# Altium schematic sheet Inverter_540VDC_V2.SchDoc
size A0; SheetNumber: 1; SheetTotal: 1; SPICEModelCacheYQEDCYZF: <root> / <DocumentId>YQEDCYZF</DocumentId> / </root>
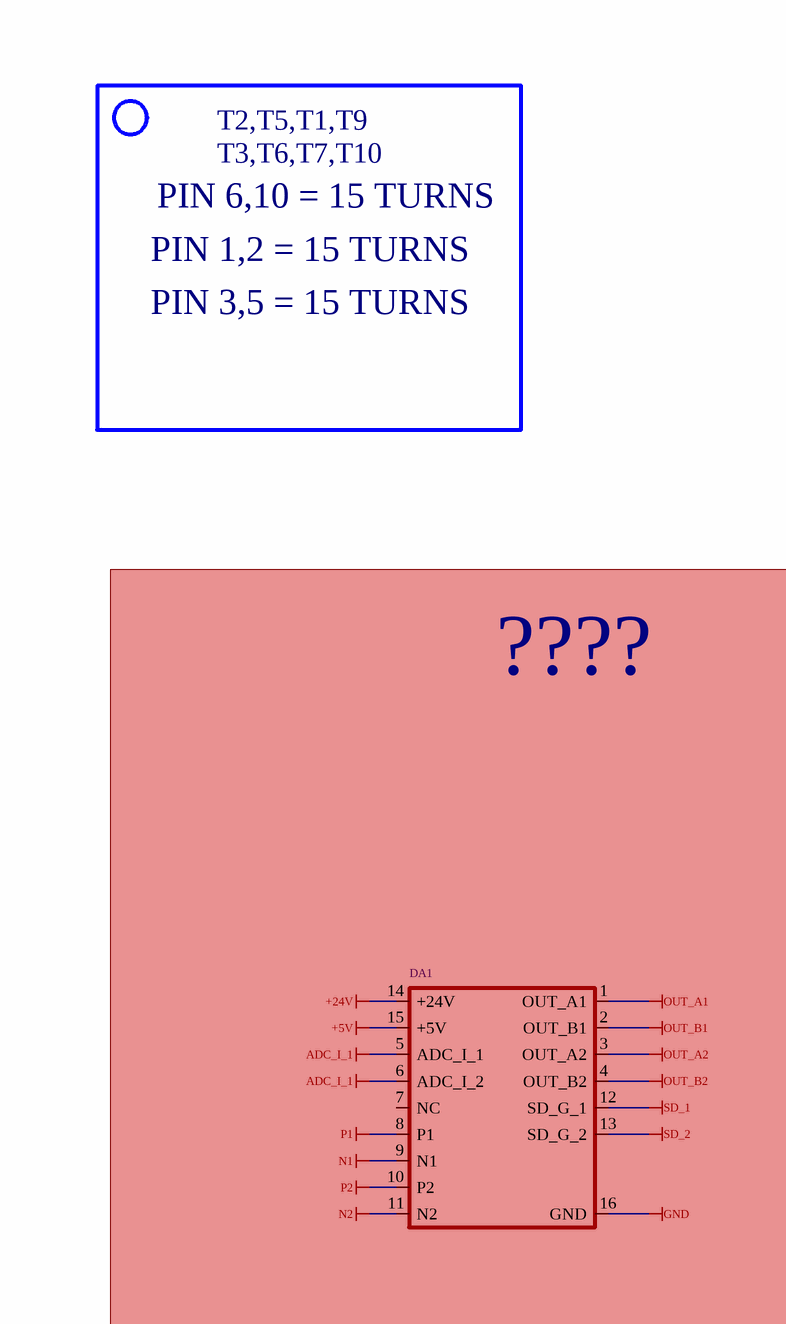
[diagram p0: Inverter_540VDC_V2.SchDoc, top left]
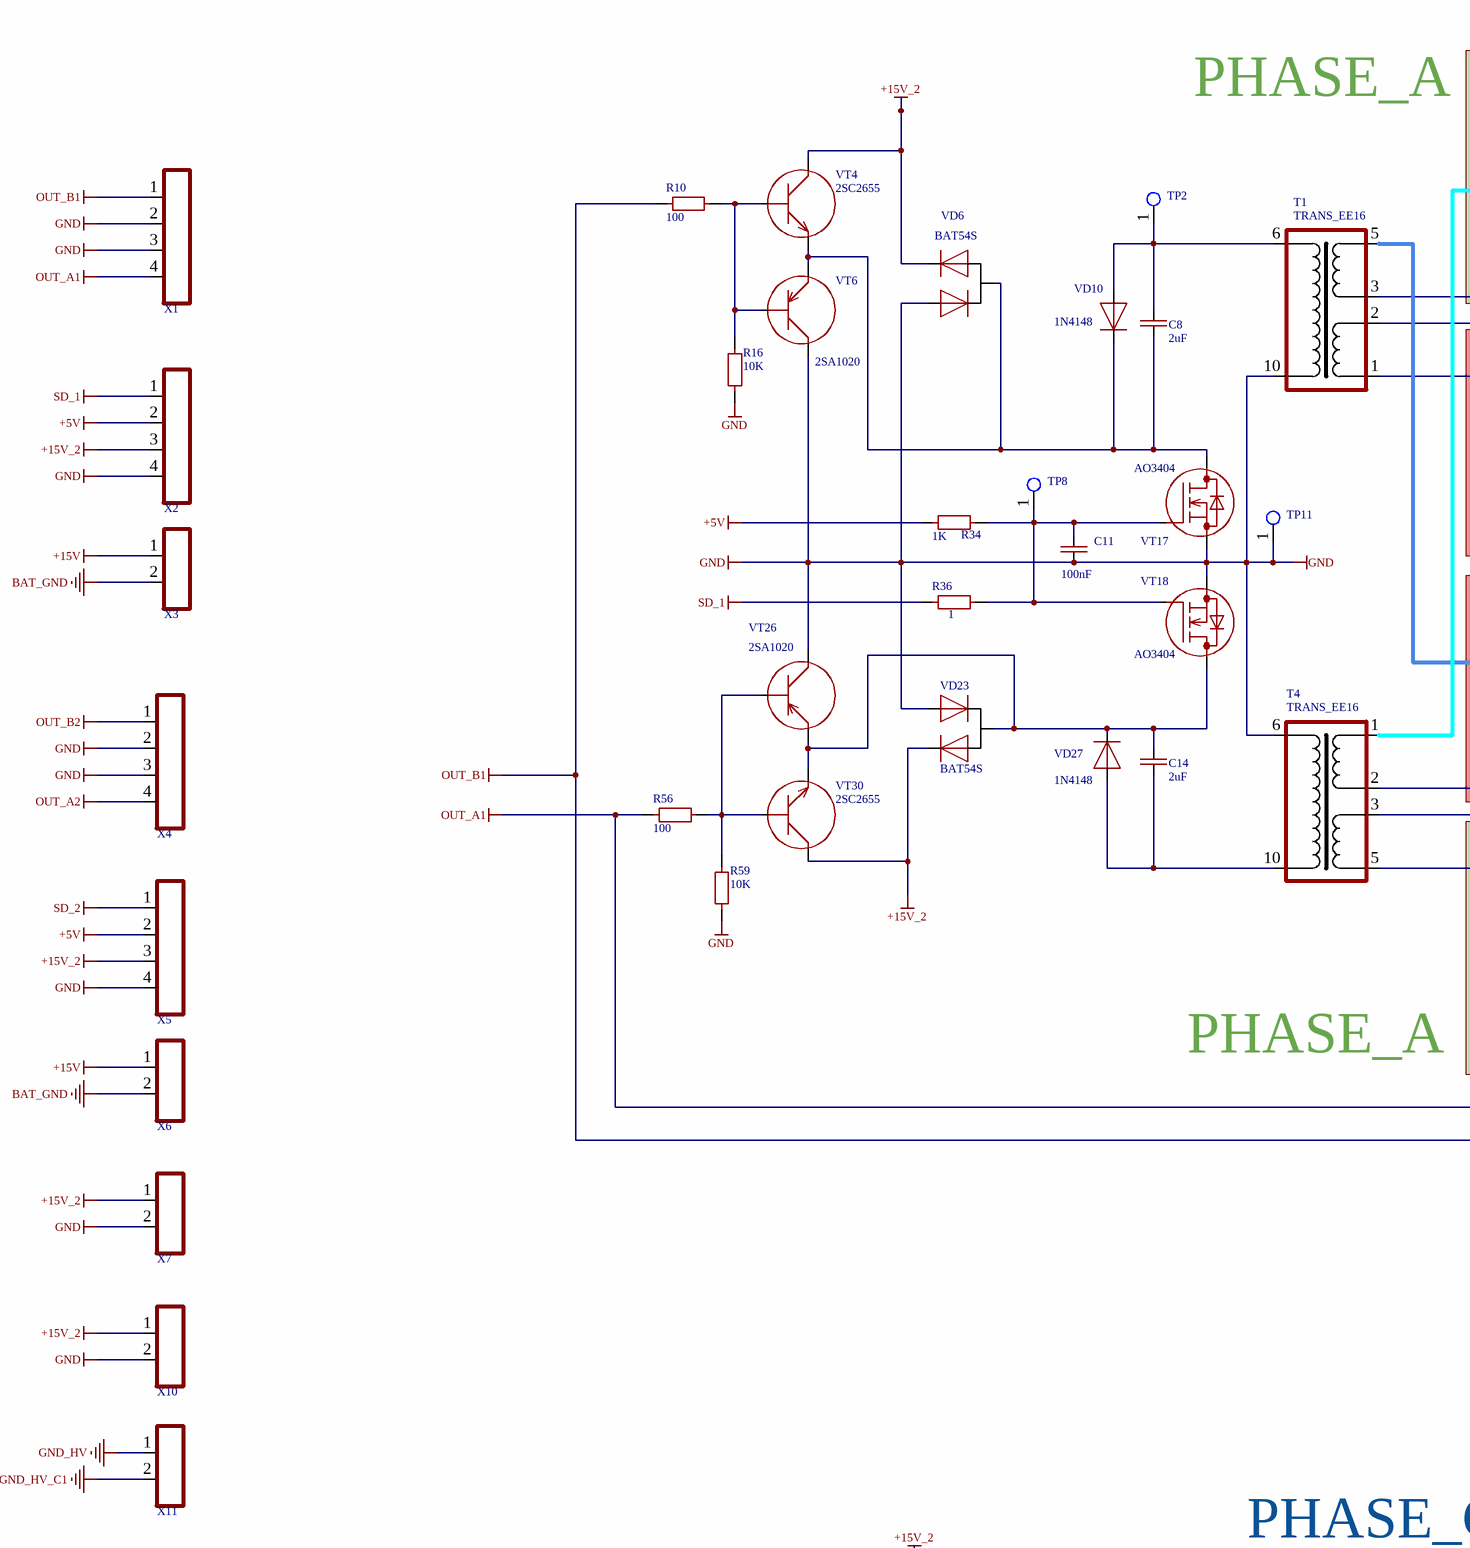
[diagram p1: Inverter_540VDC_V2.SchDoc, top middle]
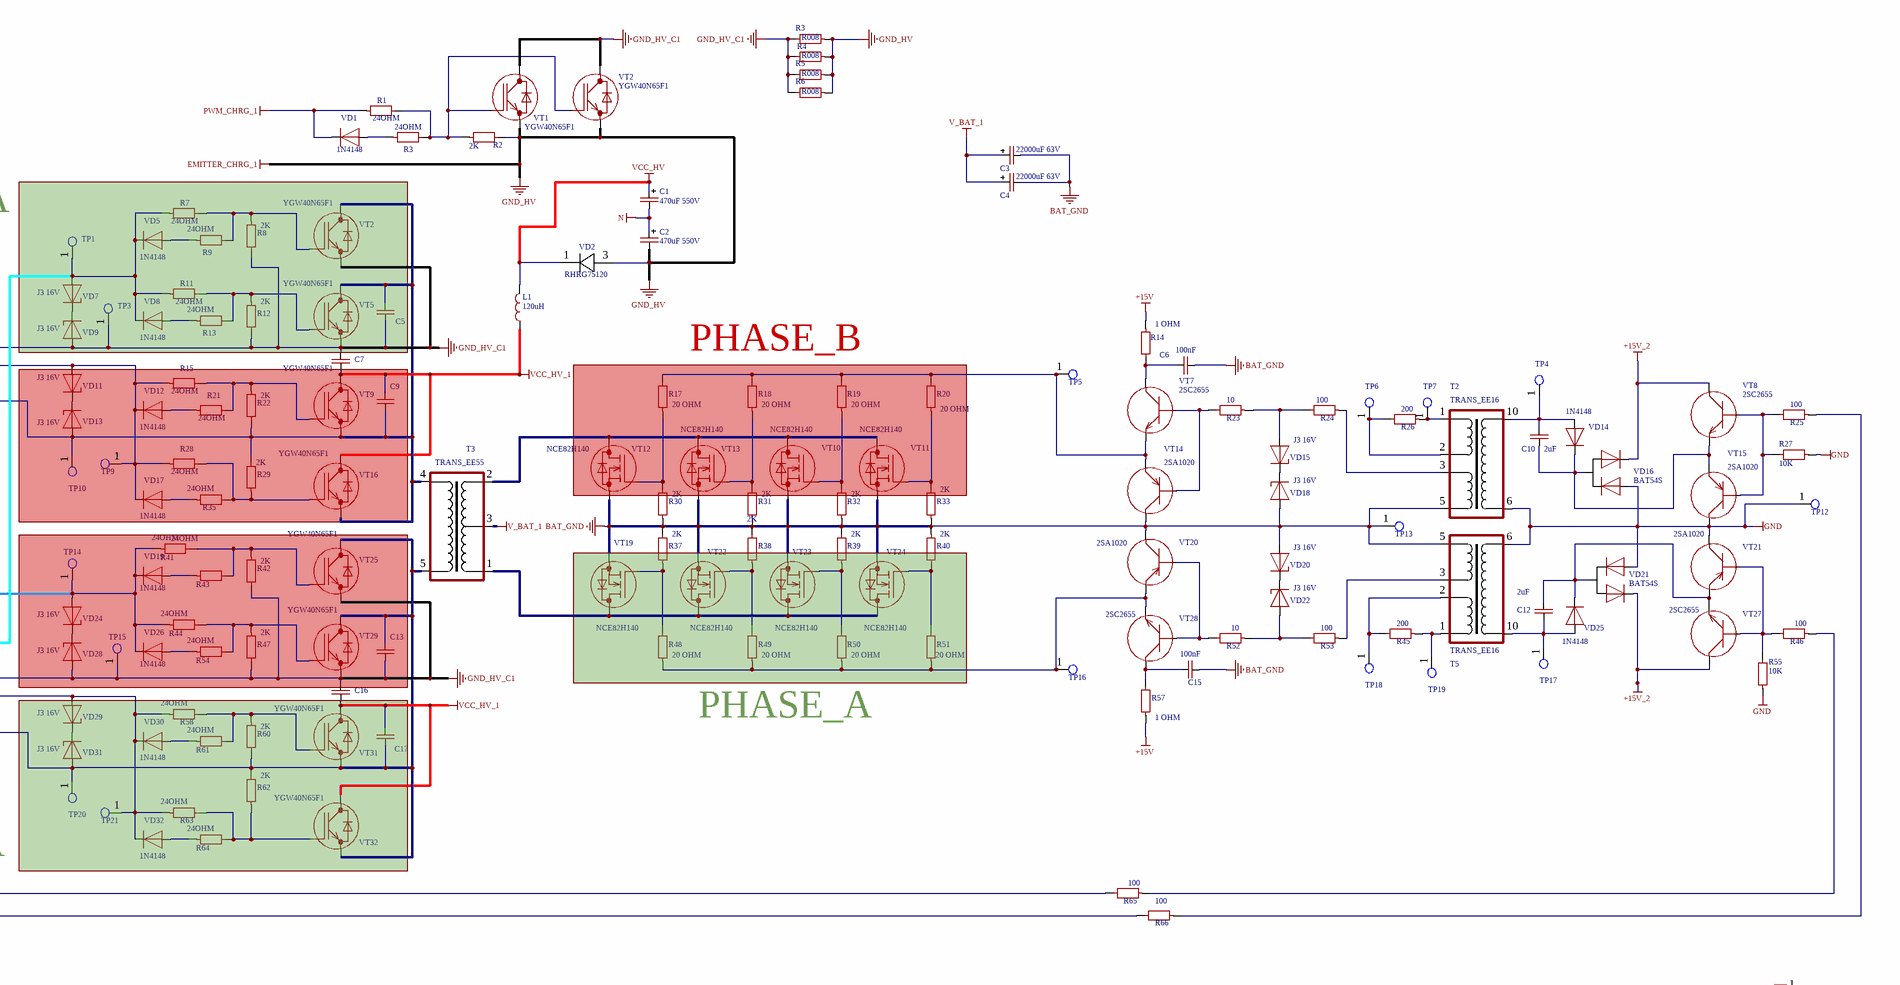
[diagram p2: Inverter_540VDC_V2.SchDoc, top right]
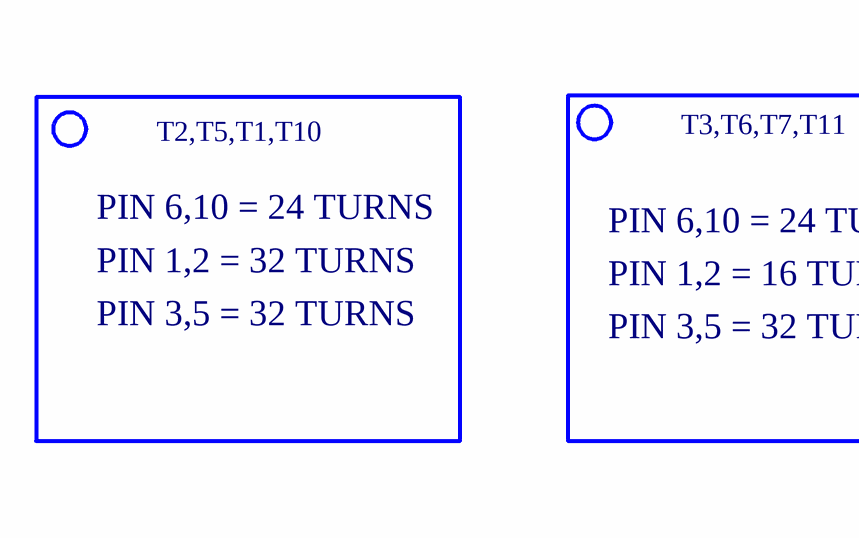
[diagram p3: Inverter_540VDC_V2.SchDoc, bottom left]
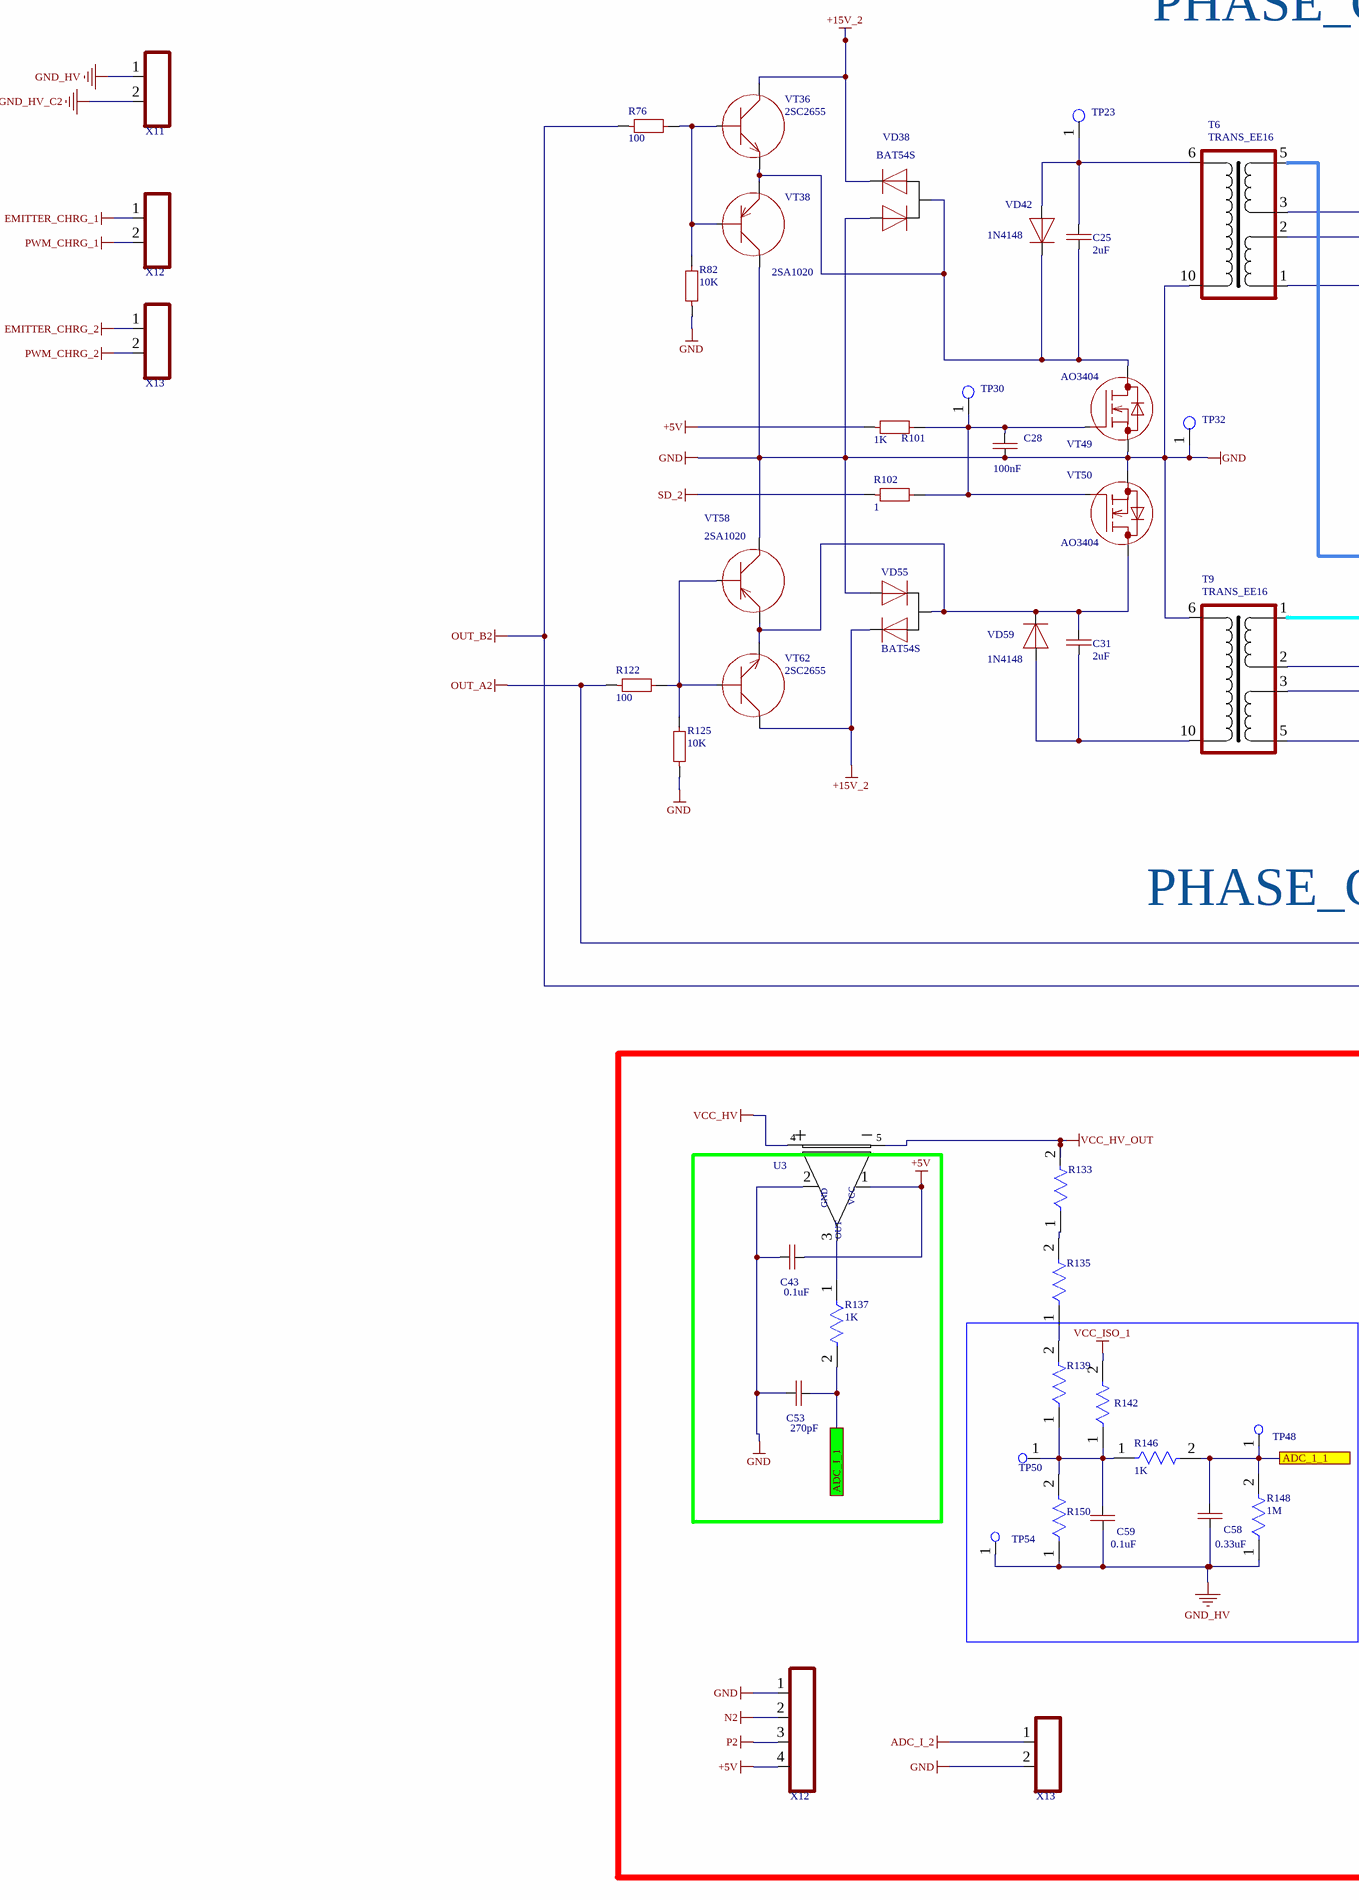
[diagram p4: Inverter_540VDC_V2.SchDoc, bottom middle]
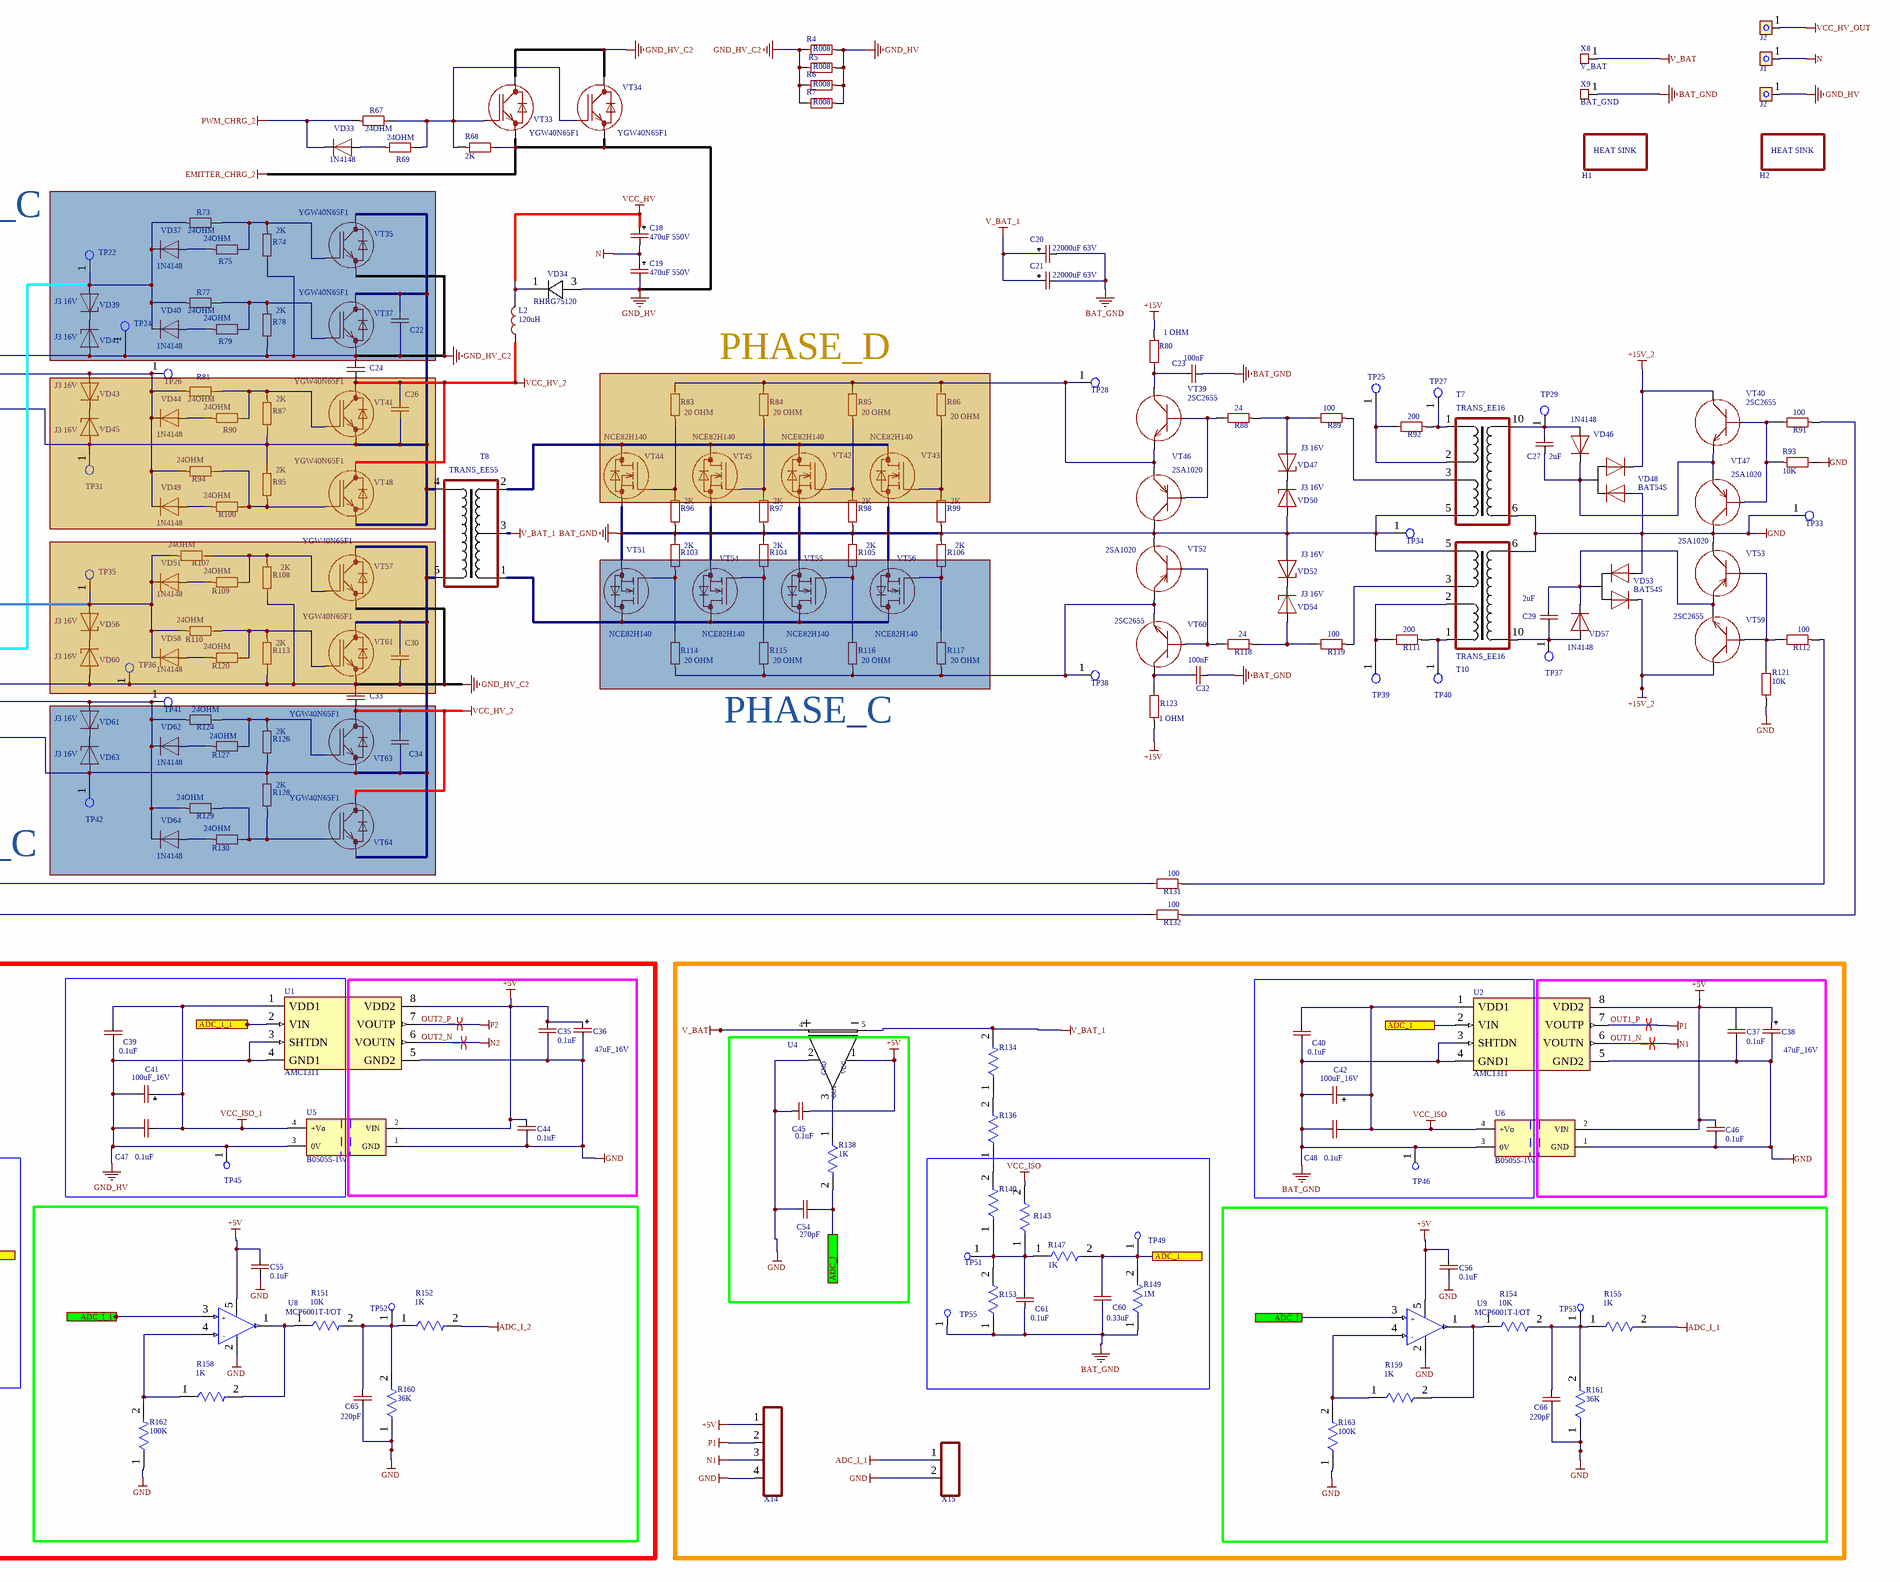
[diagram p5: Inverter_540VDC_V2.SchDoc, bottom right]

## Parts
(Parts that share a designator on the sheet are numbered #1, #2 ... from top to bottom, then left to right.)
C1  470uF 550V  [CAPPOL-65x35]
C2  470uF 550V  [CAPPOL-65x35]
C3  22000uF 63V  [CAPPOL-100x35]
C4  22000uF 63V  [CAPPOL-100x35]
C5  CAP-NON-POLAR  [CAP-FILM-22.5X26.5X10]  (value not drawn)
C6  100nF  [CAP-0805]
C7  CAP-NON-POLAR  [CAP-FILM-22.5X26.5X10]  (value not drawn)
C8  2uF  [CAP-1206]
C9  CAP-NON-POLAR  [CAP-FILM-22.5X26.5X10]  (value not drawn)
C10  2uF  [CAP-1206]
C11  100nF  [CAP-1206]
C12  2uF  [CAP-1206]
C13  CAP-NON-POLAR  [CAP-FILM-22.5X26.5X10]  (value not drawn)
C14  2uF  [CAP-1206]
C15  100nF  [CAP-0805]
C16  CAP-NON-POLAR  [CAP-FILM-22.5X26.5X10]  (value not drawn)
C17  CAP-NON-POLAR  [CAP-FILM-22.5X26.5X10]  (value not drawn)
C18  470uF 550V  [CAPPOL-65x35]
C19  470uF 550V  [CAPPOL-65x35]
C20  22000uF 63V  [CAPPOL-100x35]
C21  22000uF 63V  [CAPPOL-100x35]
C22  CAP-NON-POLAR  [CAP-FILM-22.5X26.5X10]  (value not drawn)
C23  100nF  [CAP-0805]
C24  CAP-NON-POLAR  [CAP-FILM-22.5X26.5X10]  (value not drawn)
C25  2uF  [CAP-1206]
C26  CAP-NON-POLAR  [CAP-FILM-22.5X26.5X10]  (value not drawn)
C27  2uF  [CAP-1206]
C28  100nF  [CAP-1206]
C29  2uF  [CAP-1206]
C30  CAP-NON-POLAR  [CAP-FILM-22.5X26.5X10]  (value not drawn)
C31  2uF  [CAP-1206]
C32  100nF  [CAP-0805]
C33  CAP-NON-POLAR  [CAP-FILM-22.5X26.5X10]  (value not drawn)
C34  CAP-NON-POLAR  [CAP-FILM-22.5X26.5X10]  (value not drawn)
C35  0.1uF  [CAP-0805]
C36  47uF_16V  [CAP-TAN-D]
C37  0.1uF  [CAP-0805]
C38  47uF_16V  [CAP-TAN-D]
C39  0.1uF  [CAP-0805]
C40  0.1uF  [CAP-0805]
C41  100uF_16V  [CAP-TAN-D]
C42  100uF_16V  [CAP-TAN-D]
C43  0.1uF  [CAP-0805]
C44  0.1uF  [CAP-0805]
C45  0.1uF  [CAP-0805]
C46  0.1uF  [CAP-0805]
C47  0.1uF  [CAP-0805]
C48  0.1uF  [CAP-0805]
C53  270pF  [CAP-0805]
C54  270pF  [CAP-0805]
C55  0.1uF  [CAP-0805]
C56  0.1uF  [CAP-0805]
C58  0.33uF  [CAP-0805]
C59  0.1uF  [CAP-0805]
C60  0.33uF  [CAP-0805]
C61  0.1uF  [CAP-1206]
C65  220pF  [CAP-0805]
C66  220pF  [CAP-0805]
DA1  PWM_X2_SG3525  [PWM_X2_SG3525]  (value not drawn)
H1  HEAT SINK  [HEAT SINK]  (value not drawn)
H2  HEAT SINK  [HEAT SINK]  (value not drawn)
J1  MG_136_HT  [Conn_MEIGAN_MG136HT]  (value not drawn)
J2#1  MG_136_HT  [Conn_MEIGAN_MG136HT]  (value not drawn)
J2#2  MG_136_HT  [Conn_MEIGAN_MG136HT]  (value not drawn)
L1  120uH  [DROSSEL_TOR_50X30X20]
L2  120uH  [DROSSEL_TOR_50X30X20]
R1  24OHM  [RES-0805]
R2  2K  [RES-0805]
R3#1  R008  [RES-3921]
R3#2  24OHM  [RES-0805]
R4#1  R008  [RES-3921]
R4#2  R008  [RES-3921]
R5#1  R008  [RES-3921]
R5#2  R008  [RES-3921]
R6#1  R008  [RES-3921]
R6#2  R008  [RES-3921]
R7#1  24OHM  [RES-0805]
R7#2  R008  [RES-3921]
R8  2K  [RES-0805]
R9  24OHM  [RES-0805]
R10  100  [RES-0805]
R11  24OHM  [RES-0805]
R12  2K  [RES-0805]
R13  24OHM  [RES-0805]
R14  1 OHM  [RES-2512]
R15  24OHM  [RES-0805]
R16  10K  [RES-0805]
R17  20 OHM  [RES-0805]
R18  20 OHM  [RES-0805]
R19  20 OHM  [RES-0805]
R20  20 OHM  [RES-0805]
R21  24OHM  [RES-0805]
R22  2K  [RES-0805]
R23  10  [RES-0805]
R24  100  [RES-0805]
R25  100  [RES-0805]
R26  200  [RES-2512]
R27  10K  [RES-0805]
R28  24OHM  [RES-0805]
R29  2K  [RES-0805]
R30  2K  [RES-0805]
R31  2K  [RES-0805]
R32  2K  [RES-0805]
R33  2K  [RES-0805]
R34  1K  [RES-0805]
R35  24OHM  [RES-0805]
R36  1  [RES-0805]
R37  2K  [RES-0805]
R38  2K  [RES-0805]
R39  2K  [RES-0805]
R40  2K  [RES-0805]
R41  24OHM  [RES-0805]
R42  2K  [RES-0805]
R43  24OHM  [RES-0805]
R44  24OHM  [RES-0805]
R45  200  [RES-2512]
R46  100  [RES-0805]
R47  2K  [RES-0805]
R48  20 OHM  [RES-0805]
R49  20 OHM  [RES-0805]
R50  20 OHM  [RES-0805]
R51  20 OHM  [RES-0805]
R52  10  [RES-0805]
R53  100  [RES-0805]
R54  24OHM  [RES-0805]
R55  10K  [RES-0805]
R56  100  [RES-0805]
R57  1 OHM  [RES-2512]
R58  24OHM  [RES-0805]
R59  10K  [RES-0805]
R60  2K  [RES-0805]
R61  24OHM  [RES-0805]
R62  2K  [RES-0805]
R63  24OHM  [RES-0805]
R64  24OHM  [RES-0805]
R65  100  [RES-0805]
R66  100  [RES-0805]
R67  24OHM  [RES-0805]
R68  2K  [RES-0805]
R69  24OHM  [RES-0805]
R73  24OHM  [RES-0805]
R74  2K  [RES-0805]
R75  24OHM  [RES-0805]
R76  100  [RES-0805]
R77  24OHM  [RES-0805]
R78  2K  [RES-0805]
R79  24OHM  [RES-0805]
R80  1 OHM  [RES-2512]
R81  24OHM  [RES-0805]
R82  10K  [RES-0805]
R83  20 OHM  [RES-0805]
R84  20 OHM  [RES-0805]
R85  20 OHM  [RES-0805]
R86  20 OHM  [RES-0805]
R87  2K  [RES-0805]
R88  24  [RES-0805]
R89  100  [RES-0805]
R90  24OHM  [RES-0805]
R91  100  [RES-0805]
R92  200  [RES-2512]
R93  10K  [RES-0805]
R94  24OHM  [RES-0805]
R95  2K  [RES-0805]
R96  2K  [RES-0805]
R97  2K  [RES-0805]
R98  2K  [RES-0805]
R99  2K  [RES-0805]
R100  24OHM  [RES-0805]
R101  1K  [RES-0805]
R102  1  [RES-0805]
R103  2K  [RES-0805]
R104  2K  [RES-0805]
R105  2K  [RES-0805]
R106  2K  [RES-0805]
R107  24OHM  [RES-0805]
R108  2K  [RES-0805]
R109  24OHM  [RES-0805]
R110  24OHM  [RES-0805]
R111  200  [RES-2512]
R112  100  [RES-0805]
R113  2K  [RES-0805]
R114  20 OHM  [RES-0805]
R115  20 OHM  [RES-0805]
R116  20 OHM  [RES-0805]
R117  20 OHM  [RES-0805]
R118  24  [RES-0805]
R119  100  [RES-0805]
R120  24OHM  [RES-0805]
R121  10K  [RES-0805]
R122  100  [RES-0805]
R123  1 OHM  [RES-2512]
R124  24OHM  [RES-0805]
R125  10K  [RES-0805]
R126  2K  [RES-0805]
R127  24OHM  [RES-0805]
R128  2K  [RES-0805]
R129  24OHM  [RES-0805]
R130  24OHM  [RES-0805]
R131  100  [RES-0805]
R132  100  [RES-0805]
R133  (no value)  [RES-1206]
R134  (no value)  [RES-1206]
R135  (no value)  [RES-1206]
R136  (no value)  [RES-1206]
R137  1K  [RES-0805]
R138  1K  [RES-0805]
R139  (no value)  [RES-1206]
R140  (no value)  [RES-1206]
R142  (no value)  [RES-0805]
R143  (no value)  [RES-0805]
R146  1K  [RES-0805]
R147  1K  [RES-0805]
R148  1M  [RES-0805]
R149  1M  [RES-0805]
R150  RES_1210  [RES_SMD_1210_IPC_B]  (value not drawn)
R151  10K  [RES-0805]
R152  1K  [RES-0805]
R153  RES_1210  [RES_SMD_1210_IPC_B]  (value not drawn)
R154  10K  [RES-0805]
R155  1K  [RES-0805]
R158  1K  [RES-0805]
R159  1K  [RES-0805]
R160  36K  [RES-0805]
R161  36K  [RES-0805]
R162  100K  [RES-0805]
R163  100K  [RES-0805]
T1  TRANS_EE16  [TRANS_EE16]
T2  TRANS_EE16  [TRANS_EE16]
T3  TRANS_EE55  [TRANS_EE55]
T4  TRANS_EE16  [TRANS_EE16]
T5  TRANS_EE16  [TRANS_EE16]
T6  TRANS_EE16  [TRANS_EE16]
T7  TRANS_EE16  [TRANS_EE16]
T8  TRANS_EE55  [TRANS_EE55_1]
T9  TRANS_EE16  [TRANS_EE16]
T10  TRANS_EE16  [TRANS_EE16]
TP1  Test_Point_PCB  [Test_Point]  (value not drawn)
TP2  Test_Point_PCB  [Test_Point]  (value not drawn)
TP3  Test_Point_PCB  [Test_Point]  (value not drawn)
TP4  Test_Point_PCB  [Test_Point]  (value not drawn)
TP5  Test_Point_PCB  [Test_Point]  (value not drawn)
TP6  Test_Point_PCB  [Test_Point]  (value not drawn)
TP7  Test_Point_PCB  [Test_Point]  (value not drawn)
TP8  Test_Point_PCB  [Test_Point]  (value not drawn)
TP9  Test_Point_PCB  [Test_Point]  (value not drawn)
TP10  Test_Point_PCB  [Test_Point]  (value not drawn)
TP11  Test_Point_PCB  [Test_Point]  (value not drawn)
TP12  Test_Point_PCB  [Test_Point]  (value not drawn)
TP13  Test_Point_PCB  [Test_Point]  (value not drawn)
TP14  Test_Point_PCB  [Test_Point]  (value not drawn)
TP15  Test_Point_PCB  [Test_Point]  (value not drawn)
TP16  Test_Point_PCB  [Test_Point]  (value not drawn)
TP17  Test_Point_PCB  [Test_Point]  (value not drawn)
TP18  Test_Point_PCB  [Test_Point]  (value not drawn)
TP19  Test_Point_PCB  [Test_Point]  (value not drawn)
TP20  Test_Point_PCB  [Test_Point]  (value not drawn)
TP21  Test_Point_PCB  [Test_Point]  (value not drawn)
TP22  Test_Point_PCB  [Test_Point]  (value not drawn)
TP23  Test_Point_PCB  [Test_Point]  (value not drawn)
TP24  Test_Point_PCB  [Test_Point]  (value not drawn)
TP25  Test_Point_PCB  [Test_Point]  (value not drawn)
TP26  Test_Point_PCB  [Test_Point]  (value not drawn)
TP27  Test_Point_PCB  [Test_Point]  (value not drawn)
TP28  Test_Point_PCB  [Test_Point]  (value not drawn)
TP29  Test_Point_PCB  [Test_Point]  (value not drawn)
TP30  Test_Point_PCB  [Test_Point]  (value not drawn)
TP31  Test_Point_PCB  [Test_Point]  (value not drawn)
TP32  Test_Point_PCB  [Test_Point]  (value not drawn)
TP33  Test_Point_PCB  [Test_Point]  (value not drawn)
TP34  Test_Point_PCB  [Test_Point]  (value not drawn)
TP35  Test_Point_PCB  [Test_Point]  (value not drawn)
TP36  Test_Point_PCB  [Test_Point]  (value not drawn)
TP37  Test_Point_PCB  [Test_Point]  (value not drawn)
TP38  Test_Point_PCB  [Test_Point]  (value not drawn)
TP39  Test_Point_PCB  [Test_Point]  (value not drawn)
TP40  Test_Point_PCB  [Test_Point]  (value not drawn)
TP41  Test_Point_PCB  [Test_Point]  (value not drawn)
TP42  Test_Point_PCB  [Test_Point]  (value not drawn)
TP45  Test_Point_PCB  [Pin_Test_Point(Pink)]  (value not drawn)
TP46  Test_Point_PCB  [Pin_Test_Point(Pink)]  (value not drawn)
TP48  Test_Point_PCB  [Test_Point]  (value not drawn)
TP49  Test_Point_PCB  [Test_Point]  (value not drawn)
TP50  Test_Point_PCB  [Test_Point]  (value not drawn)
TP51  Test_Point_PCB  [Test_Point]  (value not drawn)
TP52  Test_Point_PCB  [Test_Point]  (value not drawn)
TP53  Test_Point_PCB  [Test_Point]  (value not drawn)
TP54  Test_Point_PCB  [Test_Point]  (value not drawn)
TP55  Test_Point_PCB  [Test_Point]  (value not drawn)
U1  AMC1311  [FP-DWV0008A-MFG]
U2  AMC1311  [FP-DWV0008A-MFG]
U3  ACS758  [ACS758-100]  (value not drawn)
U4  ACS758  [ACS758-100]  (value not drawn)
U5  B0505S-1W  [B0505S-1W]
U6  B0505S-1W  [B0505S-1W]
U8  MCP6001T-I/OT  [SOT-23-5]
U9  MCP6001T-I/OT  [SOT-23-5]
VD1  1N4148  [SOD-123]
VD2  RHRG75120  [TO-247-2]
VD5  1N4148  [SOD-123]
VD6  BAT54S  [SOT23-3]
VD7  J3 16V  [SOD-80]
VD8  1N4148  [SOD-123]
VD9  J3 16V  [SOD-80]
VD10  1N4148  [SOD-123]
VD11  J3 16V  [SOD-80]
VD12  1N4148  [SOD-123]
VD13  J3 16V  [SOD-80]
VD14  1N4148  [SOD-123]
VD15  J3 16V  [SOD-80]
VD16  BAT54S  [SOT23-3]
VD17  1N4148  [SOD-123]
VD18  J3 16V  [SOD-80]
VD19  1N4148  [SOD-123]
VD20  J3 16V  [SOD-80]
VD21  BAT54S  [SOT23-3]
VD22  J3 16V  [SOD-80]
VD23  BAT54S  [SOT23-3]
VD24  J3 16V  [SOD-80]
VD25  1N4148  [SOD-123]
VD26  1N4148  [SOD-123]
VD27  1N4148  [SOD-123]
VD28  J3 16V  [SOD-80]
VD29  J3 16V  [SOD-80]
VD30  1N4148  [SOD-123]
VD31  J3 16V  [SOD-80]
VD32  1N4148  [SOD-123]
VD33  1N4148  [SOD-123]
VD34  RHRG75120  [TO-247-2]
VD37  1N4148  [SOD-123]
VD38  BAT54S  [SOT23-3]
VD39  J3 16V  [SOD-80]
VD40  1N4148  [SOD-123]
VD41  J3 16V  [SOD-80]
VD42  1N4148  [SOD-123]
VD43  J3 16V  [SOD-80]
VD44  1N4148  [SOD-123]
VD45  J3 16V  [SOD-80]
VD46  1N4148  [SOD-123]
VD47  J3 16V  [SOD-80]
VD48  BAT54S  [SOT23-3]
VD49  1N4148  [SOD-123]
VD50  J3 16V  [SOD-80]
VD51  1N4148  [SOD-123]
VD52  J3 16V  [SOD-80]
VD53  BAT54S  [SOT23-3]
VD54  J3 16V  [SOD-80]
VD55  BAT54S  [SOT23-3]
VD56  J3 16V  [SOD-80]
VD57  1N4148  [SOD-123]
VD58  1N4148  [SOD-123]
VD59  1N4148  [SOD-123]
VD60  J3 16V  [SOD-80]
VD61  J3 16V  [SOD-80]
VD62  1N4148  [SOD-123]
VD63  J3 16V  [SOD-80]
VD64  1N4148  [SOD-123]
VT1  YGW40N65F1  [TO-247-3]
VT2#1  YGW40N65F1  [TO-247-3]
VT2#2  YGW40N65F1  [TO-247-3]
VT4  2SC2655  [SOT-89]
VT5  YGW40N65F1  [TO-247-3]
VT6  2SA1020  [SOT-89]
VT7  2SC2655  [SOT-89]
VT8  2SC2655  [SOT-89]
VT9  YGW40N65F1  [TO-247-3]
VT10  NCE82H140  [TO-247-3]
VT11  NCE82H140  [TO-247-3]
VT12  NCE82H140  [TO-247-3]
VT13  NCE82H140  [TO-247-3]
VT14  2SA1020  [SOT-89]
VT15  2SA1020  [SOT-89]
VT16  YGW40N65F1  [TO-247-3]
VT17  AO3404  [SOT23-3]
VT18  AO3404  [SOT23-3]
VT19  NCE82H140  [TO-247-3]
VT20  2SA1020  [SOT-89]
VT21  2SA1020  [SOT-89]
VT22  NCE82H140  [TO-247-3]
VT23  NCE82H140  [TO-247-3]
VT24  NCE82H140  [TO-247-3]
VT25  YGW40N65F1  [TO-247-3]
VT26  2SA1020  [SOT-89]
VT27  2SC2655  [SOT-89]
VT28  2SC2655  [SOT-89]
VT29  YGW40N65F1  [TO-247-3]
VT30  2SC2655  [SOT-89]
VT31  YGW40N65F1  [TO-247-3]
VT32  YGW40N65F1  [TO-247-3]
VT33  YGW40N65F1  [TO-247-3]
VT34  YGW40N65F1  [TO-247-3]
VT35  YGW40N65F1  [TO-247-3]
VT36  2SC2655  [SOT-89]
VT37  YGW40N65F1  [TO-247-3]
VT38  2SA1020  [SOT-89]
VT39  2SC2655  [SOT-89]
VT40  2SC2655  [SOT-89]
VT41  YGW40N65F1  [TO-247-3]
VT42  NCE82H140  [TO-247-3]
VT43  NCE82H140  [TO-247-3]
VT44  NCE82H140  [TO-247-3]
VT45  NCE82H140  [TO-247-3]
VT46  2SA1020  [SOT-89]
VT47  2SA1020  [SOT-89]
VT48  YGW40N65F1  [TO-247-3]
VT49  AO3404  [SOT23-3]
VT50  AO3404  [SOT23-3]
VT51  NCE82H140  [TO-247-3]
VT52  2SA1020  [SOT-89]
VT53  2SA1020  [SOT-89]
VT54  NCE82H140  [TO-247-3]
VT55  NCE82H140  [TO-247-3]
VT56  NCE82H140  [TO-247-3]
VT57  YGW40N65F1  [TO-247-3]
VT58  2SA1020  [SOT-89]
VT59  2SC2655  [SOT-89]
VT60  2SC2655  [SOT-89]
VT61  YGW40N65F1  [TO-247-3]
VT62  2SC2655  [SOT-89]
VT63  YGW40N65F1  [TO-247-3]
VT64  YGW40N65F1  [TO-247-3]
X1  CONN-4-PIN  [CONN-PLS-4-2.54mm_1]  (value not drawn)
X2  CONN-4-PIN  [CONN-PLS-4-2.54mm_1]  (value not drawn)
X3  CONN-2-PIN  [XH2-]  (value not drawn)
X4  CONN-4-PIN  [CONN-PLS-4-2.54mm_1]  (value not drawn)
X5  CONN-4-PIN  [CONN-PLS-4-2.54mm_1]  (value not drawn)
X6  CONN-2-PIN  [XH2-]  (value not drawn)
X7  CONN-2-PIN  [XH2-]  (value not drawn)
X8  V_BAT  [Terminal_18x18_M8]
X9  BAT_GND  [Terminal_18x18_M8]
X10  CONN-2-PIN  [XH2-]  (value not drawn)
X11#1  CONN-2-PIN  [XH2-]  (value not drawn)
X11#2  CONN-2-PIN  [XH2-]  (value not drawn)
X12#1  CONN-2-PIN  [XH2-]  (value not drawn)
X12#2  CONN-4-PIN  [CONN-PLS-4-2.54mm_1]  (value not drawn)
X13#1  CONN-2-PIN  [XH2-]  (value not drawn)
X13#2  CONN-2-PIN  [XH2-]  (value not drawn)
X14  CONN-4-PIN  [CONN-PLS-4-2.54mm_1]  (value not drawn)
X15  CONN-2-PIN  [XH2-]  (value not drawn)

## Blocks framed on the sheet
PHASE_B: R17-R20 VT10-VT13
????: DA1
PHASE_D: R83-R86 VT42-VT45

## Ports
ADC_1, ADC_1_1, ADC_I, ADC_I_1

## Nets
+5V: C35.1 C36.1(+) C37.1 C38.1(+) C43.2 C44.1 C45.2 C46.1 C55.2 C56.2 DA1.15(+5V) R34.1 R101.1 U1.8(VDD2) U2.8(VDD2) U3.1(+VCC) U4.1(+VCC) U5.2(VIN) U6.2(VIN) U8.5(VDD) U9.5(VDD) X2.2 X5.2 X12#2.4 X14.1
+15V: R14.1 R57.1 R80.1 R123.1 X3.1 X6.1
+15V_2: VD6.2(C) VD16.2(C) VD21.2(C) VD23.2(C) VD38.2(C) VD48.2(C) VD53.2(C) VD55.2(C) VT4.2(C) VT8.2(C) VT27.2(C) VT30.2(C) VT36.2(C) VT40.2(C) VT59.2(C) VT62.2(C) X2.3 X5.3 X7.1 X10.1
+24V: DA1.14(+24V)
ADC_I_1: DA1.5(ADC_I_1) DA1.6(ADC_I_2) R155.2 X15.1
ADC_I_2: R152.2 X13#2.1
BAT_GND: C3.2(-) C4.2(-) C6.1 C15.1 C20.2(-) C21.2(-) C23.1 C32.1 C40.1 C42.2(-) C48.2 C60.1 C61.1 R30.1 R31.1 R32.1 R33.1 R37.2 R38.2 R39.2 R40.1 R96.1 R97.1 R98.1 R99.1 R103.2 R104.2 R105.2 R106.1 R149.1 R153.1 T2.5 T5.5 T7.5 T10.5 TP13.1(G9) TP34.1(G9) TP46.1(G9) TP55.1(G9) U2.3(SHTDN) U2.4(GND1) U6.3(0V) VD18.2(A) VD20.2(A) VD50.2(A) VD52.2(A) VT10.3(S) VT11.3(S) VT12.3(S) VT13.3(S) VT14.2(C) VT19.3(S) VT20.2(C) VT22.3(S) VT23.3(S) VT24.3(S) VT42.3(S) VT43.3(S) VT44.3(S) VT45.3(S) VT46.2(C) VT51.3(S) VT52.2(C) VT54.3(S) VT55.3(S) VT56.3(S) X3.2 X6.2 X9.1
EMITTER_CHRG_1: C2.2(-) C19.2(-) C39.1 C41.2(-) C47.2 C58.1 C59.1 J2#2.1 R2.2 R3#1.1 R4#1.1 R4#2.1 R5#1.1 R5#2.1 R6#1.1 R6#2.1 R7#2.1 R68.2 R148.1 R150.1 TP45.1(G9) TP54.1(G9) U1.3(SHTDN) U1.4(GND1) U5.3(0V) VD2.3 VD34.3 VT1.3(E) VT2#1.3(E) VT33.3(E) VT34.3(E) X11#1.1 X11#2.1 X12#1.1 X13#1.1  [also labelled EMITTER_CHRG_2, GND_HV]
GND: C11.1 C28.1 C35.2 C36.2(-) C37.2 C38.2(-) C43.1 C44.2 C45.1 C46.2 C53.1 C54.1 C55.1 C56.1 C65.1 C66.1 DA1.16(GND) R16.1 R27.1 R55.1 R59.1 R82.1 R93.2 R121.1 R125.1 R160.1 R161.1 R162.1 R163.1 T1.10 T2.6 T4.6 T5.6 T6.10 T7.6 T9.6 T10.6 TP11.1(G9) TP12.1(G9) TP32.1(G9) TP33.1(G9) U1.5(GND2) U2.5(GND2) U3.2(GND) U4.2(GND) U5.1(GND) U6.1(GND) U8.2(VSS) U9.2(VSS) VD6.1(A) VD16.1(A) VD21.1(A) VD23.1(A) VD38.1(A) VD48.1(A) VD53.1(A) VD55.1(A) VT6.2(C) VT15.2(C) VT17.2(S) VT18.2(S) VT21.2(C) VT26.2(C) VT38.2(C) VT47.2(C) VT49.2(S) VT50.2(S) VT53.2(C) VT58.2(C) X1.2 X1.3 X2.4 X4.2 X4.3 X5.4 X7.2 X10.2 X12#2.1 X13#2.2 X14.4 X15.2
GND_HV_C1: C5.1 C7.2 C13.1 C16.2 R3#1.2 R4#1.2 R5#1.2 R6#1.2 R8.2 R12.2 R42.2 R47.2 T1.3 T4.2 TP3.1(G9) TP15.1(G9) VD9.2(A) VD28.2(A) VT1.2(C) VT2#1.2(C) VT2#2.3(E) VT5.3(E) VT25.3(E) VT29.3(E) X11#1.2
GND_HV_C2: C22.1 C24.2 C30.1 C33.2 R4#2.2 R5#2.2 R6#2.2 R7#2.2 R74.2 R78.2 R108.2 R113.2 T6.3 T9.2 TP24.1(G9) TP36.1(G9) VD41.2(A) VD60.2(A) VT33.2(C) VT34.2(C) VT35.3(E) VT37.3(E) VT57.3(E) VT61.3(E) X11#2.2
N: C1.2(-) C2.1(+) C18.2(-) C19.1(+) J1.1
OUT1_N: DA1.9(N1) U2.6(VOUTN) X14.3  [also labelled N1]
OUT1_P: DA1.8(P1) U2.7(VOUTP) X14.2  [also labelled P1]
OUT2_N: DA1.11(N2) U1.6(VOUTN) X12#2.2  [also labelled N2]
OUT2_P: DA1.10(P2) U1.7(VOUTP) X12#2.3  [also labelled P2]
OUT_A1: DA1.1(OUT_A1) R56.1 R65.2 X1.4
OUT_A2: DA1.3(OUT_A2) R122.1 R131.2 X4.4
OUT_B1: DA1.2(OUT_B1) R10.1 R66.2 X1.1
OUT_B2: DA1.4(OUT_B2) R76.1 R132.2 X4.1
PWM_CHRG_1: R1.1 VD1.1(C) X12#1.2
PWM_CHRG_2: R67.1 VD33.1(C) X13#1.2
SD_1: DA1.12(SD_G_1) R36.1 X2.1
SD_2: DA1.13(SD_G_2) R102.1 X5.1
V_BAT: U4.4(+IP) X8.1
V_BAT_1: C3.1(+) C4.1(+) C20.1(+) C21.1(+) R134.2 T3.3 T8.3 U4.5(-IP)
VCC_HV: C1.1(+) C18.1(+) L1.2 L2.2 U3.4(+IP) VD2.1 VD34.1
VCC_HV_1: C7.1 C9.2 C16.1 C17.2 L1.1 VT9.2(C) VT16.2(C) VT31.2(C) VT32.2(C)
VCC_HV_2: C24.1 C26.2 C33.1 C34.2 L2.1 VT41.2(C) VT48.2(C) VT63.2(C) VT64.2(C)
VCC_HV_OUT: J2#1.1 R133.2 U3.5(-IP)
VCC_ISO: C40.2 C42.1(+) C48.1 R143.2 U2.1(VDD1) U6.4(+Vo)
VCC_ISO_1: C39.2 C41.1(+) C47.1 R142.2 U1.1(VDD1) U5.4(+Vo)
ADC_1: C60.2 R147.2 R149.2 TP49.1(G9) U2.2(VIN) ; port ADC_1
ADC_1_1: C58.2 R146.2 R148.2 TP48.1(G9) U1.2(VIN) ; port ADC_1_1
ADC_I: C54.2 R138.2 U9.3(VIN+) ; port ADC_I
ADC_I_1: C53.2 R137.2 U8.3(VIN+) ; port ADC_I_1  [a separate net that carries the same name]
NetC5_2: C5.2 C9.1 R22.2 R29.2 T1.1 T3.4 TP10.1(G9) VD13.2(A) VT2#2.2(C) VT5.2(C) VT9.3(E) VT16.3(E)
NetC6_2: C6.2 R14.2 VT7.2(C)
NetC8_1: C8.1 VD6.3(x) VD10.1(C) VT4.3(E) VT6.3(E) VT17.3(D)
NetC8_2: C8.2 T1.6 TP2.1(G9) VD10.2(A)
NetC10_1: C10.1 T2.10 TP4.1(G9) VD14.2(A)
NetC10_2: C10.2 VD14.1(C) VD16.3(x) VT8.3(E) VT15.3(E)
NetC11_2: C11.2 R34.2 R36.2 TP8.1(G9) VT17.1(G) VT18.1(G)
NetC12_1: C12.1 VD21.3(x) VD25.1(C) VT21.3(E) VT27.3(E)
NetC12_2: C12.2 T5.10 TP17.1(G9) VD25.2(A)
NetC13_2: C13.2 C17.1 R60.2 R62.2 T3.5 T4.5 TP20.1(G9) VD31.2(A) VT25.2(C) VT29.2(C) VT31.3(E) VT32.3(E)
NetC14_1: C14.1 T4.10 VD27.2(A)
NetC14_2: C14.2 VD23.3(x) VD27.1(C) VT18.3(D) VT26.3(E) VT30.3(E)
NetC15_2: C15.2 R57.2 VT28.2(C)
NetC22_2: C22.2 C26.1 R87.2 R95.2 T6.1 T8.4 TP31.1(G9) VD45.2(A) VT35.2(C) VT37.2(C) VT41.3(E) VT48.3(E)
NetC23_2: C23.2 R80.2 VT39.2(C)
NetC25_1: C25.1 VD38.3(x) VD42.1(C) VT36.3(E) VT38.3(E) VT49.3(D)
NetC25_2: C25.2 T6.6 TP23.1(G9) VD42.2(A)
NetC27_1: C27.1 T7.10 TP29.1(G9) VD46.2(A)
NetC27_2: C27.2 VD46.1(C) VD48.3(x) VT40.3(E) VT47.3(E)
NetC28_2: C28.2 R101.2 R102.2 TP30.1(G9) VT49.1(G) VT50.1(G)
NetC29_1: C29.1 VD53.3(x) VD57.1(C) VT53.3(E) VT59.3(E)
NetC29_2: C29.2 T10.10 TP37.1(G9) VD57.2(A)
NetC30_2: C30.2 C34.1 R126.2 R128.2 T8.5 T9.5 TP42.1(G9) VD63.2(A) VT57.2(C) VT61.2(C) VT63.3(E) VT64.3(E)
NetC31_1: C31.1 T9.10 VD59.2(A)
NetC31_2: C31.2 VD55.3(x) VD59.1(C) VT50.3(D) VT58.3(E) VT62.3(E)
NetC32_2: C32.2 R123.2 VT60.2(C)
NetC59_2: C59.2 R139.1 R142.1 R146.1 R150.2 TP50.1(G9)
NetC61_2: C61.2 R140.1 R143.1 R147.1 R153.2 TP51.1(G9)
NetC65_2: C65.2 R151.2 R152.1 R160.2 TP52.1(G9)
NetC66_2: C66.2 R154.2 R155.1 R161.2 TP53.1(G9)
NetR1_2: R1.2 R2.1 R3#2.2 VT1.1(G) VT2#1.1(G)
NetR3#2_1: R3#2.1 VD1.2(A)
NetR7#1_1: R7#1.1 R11.1 T4.1 TP1.1(G9) VD5.1(C) VD7.2(A) VD8.1(C)
NetR7#1_2: R7#1.2 R8.1 R9.2 VT2#2.1(G)
NetR9_1: R9.1 VD5.2(A)
NetR10_2: R10.2 R16.2 VT4.1(B) VT6.1(B)
NetR11_2: R11.2 R12.1 R13.2 VT5.1(G)
NetR13_1: R13.1 VD8.2(A)
NetR15_1: R15.1 R28.1 T1.2 TP9.1(G9) VD11.2(A) VD12.1(C) VD17.1(C)
NetR15_2: R15.2 R21.2 R22.1 VT9.1(G)
NetR17_1: R17.1 R30.2 VT12.1(G)
NetR17_2: R17.2 R18.2 R19.2 R20.2 TP5.1(G9) VT7.3(E) VT14.3(E)
NetR18_1: R18.1 R31.2 VT13.1(G)
NetR19_1: R19.1 R32.2 VT10.1(G)
NetR20_1: R20.1 R33.2 VT11.1(G)
NetR21_1: R21.1 VD12.2(A)
NetR23_1: R23.1 R24.2 VD15.2(A)
NetR23_2: R23.2 VT7.1(B) VT14.1(B)
NetR24_1: R24.1 T2.3
NetR25_1: R25.1 R66.1
NetR25_2: R25.2 R27.2 VT8.1(B) VT15.1(B)
NetR26_1: R26.1 T2.1 TP7.1(G9)
NetR26_2: R26.2 T2.2 TP6.1(G9)
NetR28_2: R28.2 R29.1 R35.2 VT16.1(G)
NetR35_1: R35.1 VD17.2(A)
NetR37_1: R37.1 R48.2 VT19.1(G)
NetR38_1: R38.1 R49.2 VT22.1(G)
NetR39_1: R39.1 R50.2 VT23.1(G)
NetR40_2: R40.2 R51.2 VT24.1(G)
NetR41_1: R41.1 R44.1 T1.5 TP14.1(G9) VD19.1(C) VD24.2(A) VD26.1(C)
NetR41_2: R41.2 R42.1 R43.2 VT25.1(G)
NetR43_1: R43.1 VD19.2(A)
NetR44_2: R44.2 R47.1 R54.2 VT29.1(G)
NetR45_1: R45.1 T5.1 TP19.1(G9)
NetR45_2: R45.2 T5.2 TP18.1(G9)
NetR46_1: R46.1 R65.1
NetR46_2: R46.2 R55.2 VT21.1(B) VT27.1(B)
NetR48_1: R48.1 R49.1 R50.1 R51.1 TP16.1(G9) VT20.3(E) VT28.3(E)
NetR52_1: R52.1 R53.2 VD22.2(A)
NetR52_2: R52.2 VT20.1(B) VT28.1(B)
NetR53_1: R53.1 T5.3
NetR54_1: R54.1 VD26.2(A)
NetR56_2: R56.2 R59.2 VT26.1(B) VT30.1(B)
NetR58_1: R58.1 R63.1 T4.3 TP21.1(G9) VD29.2(A) VD30.1(C) VD32.1(C)
NetR58_2: R58.2 R60.1 R61.2 VT31.1(G)
NetR61_1: R61.1 VD30.2(A)
NetR62_1: R62.1 R63.2 R64.2 VT32.1(G)
NetR64_1: R64.1 VD32.2(A)
NetR67_2: R67.2 R68.1 R69.2 VT33.1(G) VT34.1(G)
NetR69_1: R69.1 VD33.2(A)
NetR73_1: R73.1 R77.1 T9.1 TP22.1(G9) VD37.1(C) VD39.2(A) VD40.1(C)
NetR73_2: R73.2 R74.1 R75.2 VT35.1(G)
NetR75_1: R75.1 VD37.2(A)
NetR76_2: R76.2 R82.2 VT36.1(B) VT38.1(B)
NetR77_2: R77.2 R78.1 R79.2 VT37.1(G)
NetR79_1: R79.1 VD40.2(A)
NetR81_1: R81.1 R94.1 T6.2 TP26.1(G9) VD43.2(A) VD44.1(C) VD49.1(C)
NetR81_2: R81.2 R87.1 R90.2 VT41.1(G)
NetR83_1: R83.1 R96.2 VT44.1(G)
NetR83_2: R83.2 R84.2 R85.2 R86.2 TP28.1(G9) VT39.3(E) VT46.3(E)
NetR84_1: R84.1 R97.2 VT45.1(G)
NetR85_1: R85.1 R98.2 VT42.1(G)
NetR86_1: R86.1 R99.2 VT43.1(G)
NetR88_1: R88.1 R89.2 VD47.2(A)
NetR88_2: R88.2 VT39.1(B) VT46.1(B)
NetR89_1: R89.1 T7.3
NetR90_1: R90.1 VD44.2(A)
NetR91_1: R91.1 R132.1
NetR91_2: R91.2 R93.1 VT40.1(B) VT47.1(B)
NetR92_1: R92.1 T7.1 TP27.1(G9)
NetR92_2: R92.2 T7.2 TP25.1(G9)
NetR94_2: R94.2 R95.1 R100.2 VT48.1(G)
NetR100_1: R100.1 VD49.2(A)
NetR103_1: R103.1 R114.2 VT51.1(G)
NetR104_1: R104.1 R115.2 VT54.1(G)
NetR105_1: R105.1 R116.2 VT55.1(G)
NetR106_2: R106.2 R117.2 VT56.1(G)
NetR107_1: R107.1 R110.1 T6.5 TP35.1(G9) VD51.1(C) VD56.2(A) VD58.1(C)
NetR107_2: R107.2 R108.1 R109.2 VT57.1(G)
NetR109_1: R109.1 VD51.2(A)
NetR110_2: R110.2 R113.1 R120.2 VT61.1(G)
NetR111_1: R111.1 T10.1 TP40.1(G9)
NetR111_2: R111.2 T10.2 TP39.1(G9)
NetR112_1: R112.1 R131.1
NetR112_2: R112.2 R121.2 VT53.1(B) VT59.1(B)
NetR114_1: R114.1 R115.1 R116.1 R117.1 TP38.1(G9) VT52.3(E) VT60.3(E)
NetR118_1: R118.1 R119.2 VD54.2(A)
NetR118_2: R118.2 VT52.1(B) VT60.1(B)
NetR119_1: R119.1 T10.3
NetR120_1: R120.1 VD58.2(A)
NetR122_2: R122.2 R125.2 VT58.1(B) VT62.1(B)
NetR124_1: R124.1 R129.1 T9.3 TP41.1(G9) VD61.2(A) VD62.1(C) VD64.1(C)
NetR124_2: R124.2 R126.1 R127.2 VT63.1(G)
NetR127_1: R127.1 VD62.2(A)
NetR128_1: R128.1 R129.2 R130.2 VT64.1(G)
NetR130_1: R130.1 VD64.2(A)
NetR133_1: R133.1 R135.2
NetR134_1: R134.1 R136.2
NetR135_1: R135.1 R139.2
NetR136_1: R136.1 R140.2
NetR137_1: R137.1 U3.3(OUT)
NetR138_1: R138.1 U4.3(OUT)
NetR151_1: R151.1 R158.2 U8.1(VOUT)
NetR154_1: R154.1 R159.2 U9.1(VOUT)
NetR158_1: R158.1 R162.2 U8.4(VIN-)
NetR159_1: R159.1 R163.2 U9.4(VIN-)
NetT3_1: T3.1 VT19.2(D) VT22.2(D) VT23.2(D) VT24.2(D)
NetT3_2: T3.2 VT10.2(D) VT11.2(D) VT12.2(D) VT13.2(D)
NetT8_1: T8.1 VT51.2(D) VT54.2(D) VT55.2(D) VT56.2(D)
NetT8_2: T8.2 VT42.2(D) VT43.2(D) VT44.2(D) VT45.2(D)
NetVD7_1: VD7.1(C) VD9.1(C)
NetVD11_1: VD11.1(C) VD13.1(C)
NetVD15_1: VD15.1(C) VD18.1(C)
NetVD20_1: VD20.1(C) VD22.1(C)
NetVD24_1: VD24.1(C) VD28.1(C)
NetVD29_1: VD29.1(C) VD31.1(C)
NetVD39_1: VD39.1(C) VD41.1(C)
NetVD43_1: VD43.1(C) VD45.1(C)
NetVD47_1: VD47.1(C) VD50.1(C)
NetVD52_1: VD52.1(C) VD54.1(C)
NetVD56_1: VD56.1(C) VD60.1(C)
NetVD61_1: VD61.1(C) VD63.1(C)

Not connected (* = marked no-connect by the designer): DA1 7(NC)

## Layout directives
differential pair: (no net found under the mark), OUT1_N, OUT2_N

## Notes on the sheet
- T2,T5,T1,T9
- T3,T6,T7,T10
- PIN 6,10 = 15 TURNS
- PIN 1,2 = 15 TURNS
- PIN 3,5 = 15 TURNS
- PHASE_A
- PHASE_C
- T2,T5,T1,T10
- T3,T6,T7,T11
- PIN 6,10 = 24 TURNS
- PIN 1,2 = 32 TURNS
- PIN 3,5 = 32 TURNS
- PIN 1,2 = 16 TURNS
- (in symbol ACS758) VCC
- (in symbol MCP6001T) +; -

## Library data of the parts
C1-C4 C18-C21 C36 C38 = CAP-POLAR
C6 C8 C10-C12 C14 C15 C23 C25 C27-C29 C31 C32 C35 C37 C39 C40 C43-C48 C53-C56 C58-C61 C65 C66 = CAP-NON-POLAR
C41 C42 = CAP_POL_SMD
J1 J2#1 J2#2 = Connector_MEIGAN_MG136HT
L1 L2 = IND-CONST
R1 R2 R3#1 R3#2 R4#1 R4#2 R5#1 R5#2 R6#1 R6#2 R7#1 R7#2 R8-R69 R73-R140 R142 R143 R146-R149 R151 R154 R160-R163 = RES-CONST
R152 R155 R158 R159 = RES-CONST: 10K
TP1-TP42 TP45 TP46 TP48-TP55 = TP_PCB?: Test_Point
U8 U9 = MCP6001T: IC OPAMP GP 1 CIRCUIT SOT23-5; Number of Amplifiers: 1; Voltage: 6V; Power Supply Rejection Ratio (PSRR): 86dB; Common Mode Rejection Ratio: 60dB; Unity Gain Bandwidth Product: 1MHz; Slew Rate: 0.6V/µs; Output Current per Channel: 23mA; Nominal Supply Current: 100uA; Input Offset Voltage (Vos): 4.5mV; Input Bias Current: 1pA; Operating Supply Voltage: 5.5V; Min Supply Voltage: 1.8V; Voltage Gain: 112dB; Length: 3.1mm; REACH SVHC: No SVHC; Number of Pins: 5; Package Quantity: 1; Radiation Hardening: No; Mount: Surface Mount; Number of Circuits: 1; Number of Elements: 1; Output Current: 23mA; Packaging: Tape and Reel; Height: 1.3mm; Lead Free: Lead Free; Min Operating Temperature: -40°C; Bandwidth: 1MHz; Contact Plating: Tin; Max Supply Voltage: 6V; Max Operating Temperature: 85°C; Width: 1.8mm; Case/Package: SOT-23; Operating Supply Current: 100uA; Number of Channels: 1; Gain Bandwidth Product: 1MHz
VD1 VD5 VD8 VD10 VD12 VD14 VD17 VD19 VD25-VD27 VD30 VD32 VD33 VD37 VD40 VD42 VD44 VD46 VD49 VD51 VD57-VD59 VD62 VD64 = DIODE
VD2 VD34 = MUR4060
VD6 VD16 VD21 VD23 VD38 VD48 VD53 VD55 = DIODE-4
VD7 VD9 VD11 VD13 VD15 VD18 VD20 VD22 VD24 VD28 VD29 VD31 VD39 VD41 VD43 VD45 VD47 VD50 VD52 VD54 VD56 VD60 VD61 VD63 = ZENER
VT1 VT2#1 VT2#2 VT5 VT9 VT16 VT25 VT29 VT31-VT35 VT37 VT41 VT48 VT57 VT61 VT63 VT64 = IGBT-N-GCE
VT4 VT7 VT8 VT27 VT28 VT30 VT36 VT39 VT40 VT59 VT60 VT62 = BIPOLAR-NPN-BEC
VT6 VT14 VT15 VT20 VT21 VT26 VT38 VT46 VT47 VT52 VT53 VT58 = BIPOLAR-PNP-BCE
VT10-VT13 VT17-VT19 VT22-VT24 VT42-VT45 VT49-VT51 VT54-VT56 = MOSFET-N-GDS
X8 X9 = Terminal_18x18_M8